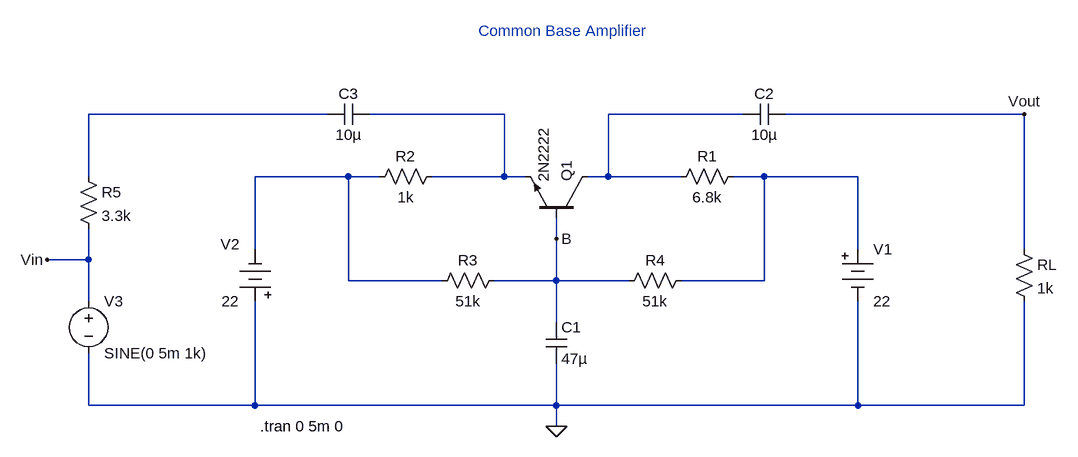
[diagram p0: schematic 2EEB_VELASCO_EXPT7_CKT6.asc]
2EEB_VELASCO_EXPT7_CKT6.asc, the LTspice schematic file:
Version 4
SHEET 1 880 680
WIRE -592 -128 -960 -128
WIRE -320 -128 -528 -128
WIRE 48 -128 -160 -128
WIRE 480 -128 112 -128
WIRE -960 -32 -960 -128
WIRE -560 -32 -704 -32
WIRE -512 -32 -560 -32
WIRE -320 -32 -320 -128
WIRE -320 -32 -432 -32
WIRE -288 -32 -320 -32
WIRE -160 -32 -160 -128
WIRE -160 -32 -192 -32
WIRE -48 -32 -160 -32
WIRE 80 -32 32 -32
WIRE 224 -32 80 -32
WIRE -240 64 -240 32
WIRE -704 80 -704 -32
WIRE 224 80 224 -32
WIRE 480 80 480 -128
WIRE -960 96 -960 48
WIRE -960 96 -1024 96
WIRE -560 128 -560 -32
WIRE -416 128 -560 128
WIRE -240 128 -240 64
WIRE -240 128 -336 128
WIRE -128 128 -240 128
WIRE 80 128 80 -32
WIRE 80 128 -48 128
WIRE -960 160 -960 96
WIRE -240 192 -240 128
WIRE -960 320 -960 240
WIRE -704 320 -704 160
WIRE -704 320 -960 320
WIRE -240 320 -240 256
WIRE -240 320 -704 320
WIRE 224 320 224 160
WIRE 224 320 -240 320
WIRE 480 320 480 160
WIRE 480 320 224 320
WIRE -240 352 -240 320
FLAG -240 352 0
FLAG -240 64 B
FLAG 480 -128 Vout
FLAG -1024 96 Vin
SYMBOL npn -192 32 M270
SYMATTR InstName Q1
SYMATTR Value 2N2222
SYMBOL res 48 -48 R90
WINDOW 0 0 56 VBottom 2
WINDOW 3 32 56 VTop 2
SYMATTR InstName R1
SYMATTR Value 6.8k
SYMBOL res -416 -48 R90
WINDOW 0 0 56 VBottom 2
WINDOW 3 32 56 VTop 2
SYMATTR InstName R2
SYMATTR Value 1k
SYMBOL res -320 112 R90
WINDOW 0 0 56 VBottom 2
WINDOW 3 32 56 VTop 2
SYMATTR InstName R3
SYMATTR Value 51k
SYMBOL cap -256 192 R0
SYMATTR InstName C1
SYMATTR Value 47µ
SYMBOL res -32 112 R90
WINDOW 0 0 56 VBottom 2
WINDOW 3 32 56 VTop 2
SYMATTR InstName R4
SYMATTR Value 51k
SYMBOL cap -528 -144 R90
WINDOW 0 0 32 VBottom 2
WINDOW 3 32 32 VTop 2
SYMATTR InstName C3
SYMATTR Value 10µ
SYMBOL cap 112 -144 R90
WINDOW 0 0 32 VBottom 2
WINDOW 3 32 32 VTop 2
SYMATTR InstName C2
SYMATTR Value 10µ
SYMBOL res -976 -48 R0
SYMATTR InstName R5
SYMATTR Value 3.3k
SYMBOL voltage -960 144 R0
SYMATTR InstName V3
SYMATTR Value SINE(0 5m 1k)
SYMBOL Misc\\battery 224 64 R0
SYMATTR InstName V1
SYMATTR Value 22
SYMBOL Misc\\battery -704 176 R180
WINDOW 0 24 104 Left 2
WINDOW 3 24 16 Left 2
SYMATTR InstName V2
SYMATTR Value 22
SYMBOL res 464 64 R0
SYMATTR InstName RL
SYMATTR Value 1k
TEXT -696 352 Left 2 !.tran 0 5m 0
TEXT -360 -256 Left 2 ;Common Base Amplifier

The netlist it stands for:
* 2EEB_VELASCO_EXPT7_CKT6.asc
Q1 N003 B N002 0 2N2222
R1 N005 N003 6.8k
R2 N002 N004 1k
R3 B N004 51k
C1 B 0 47µ
R4 N005 B 51k
C3 N002 N001 10µ
C2 Vout N003 10µ
R5 N001 Vin 3.3k
V3 Vin 0 SINE(0 5m 1k)
V1 N005 0 22
V2 0 N004 22
RL Vout 0 1k
.model NPN NPN
.model PNP PNP
.lib standard.bjt
.tran 0 5m 0
* Common Base Amplifier
.backanno
.end